# EAGLE schematic serv_open8_sotb (EAGLE 9.6.2)
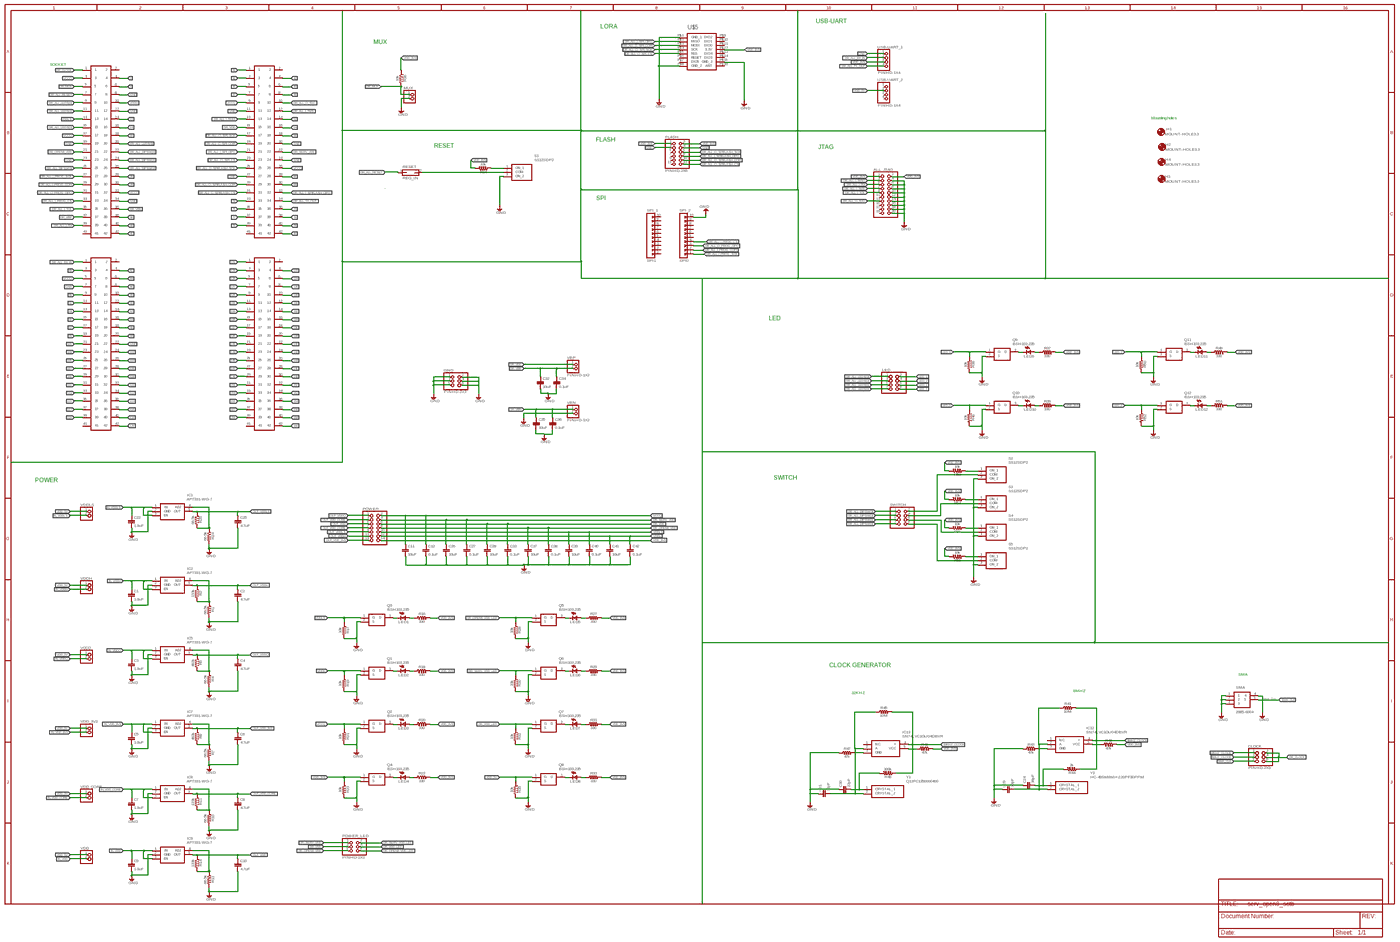
[diagram p0: schematic, sheet 1, overview]
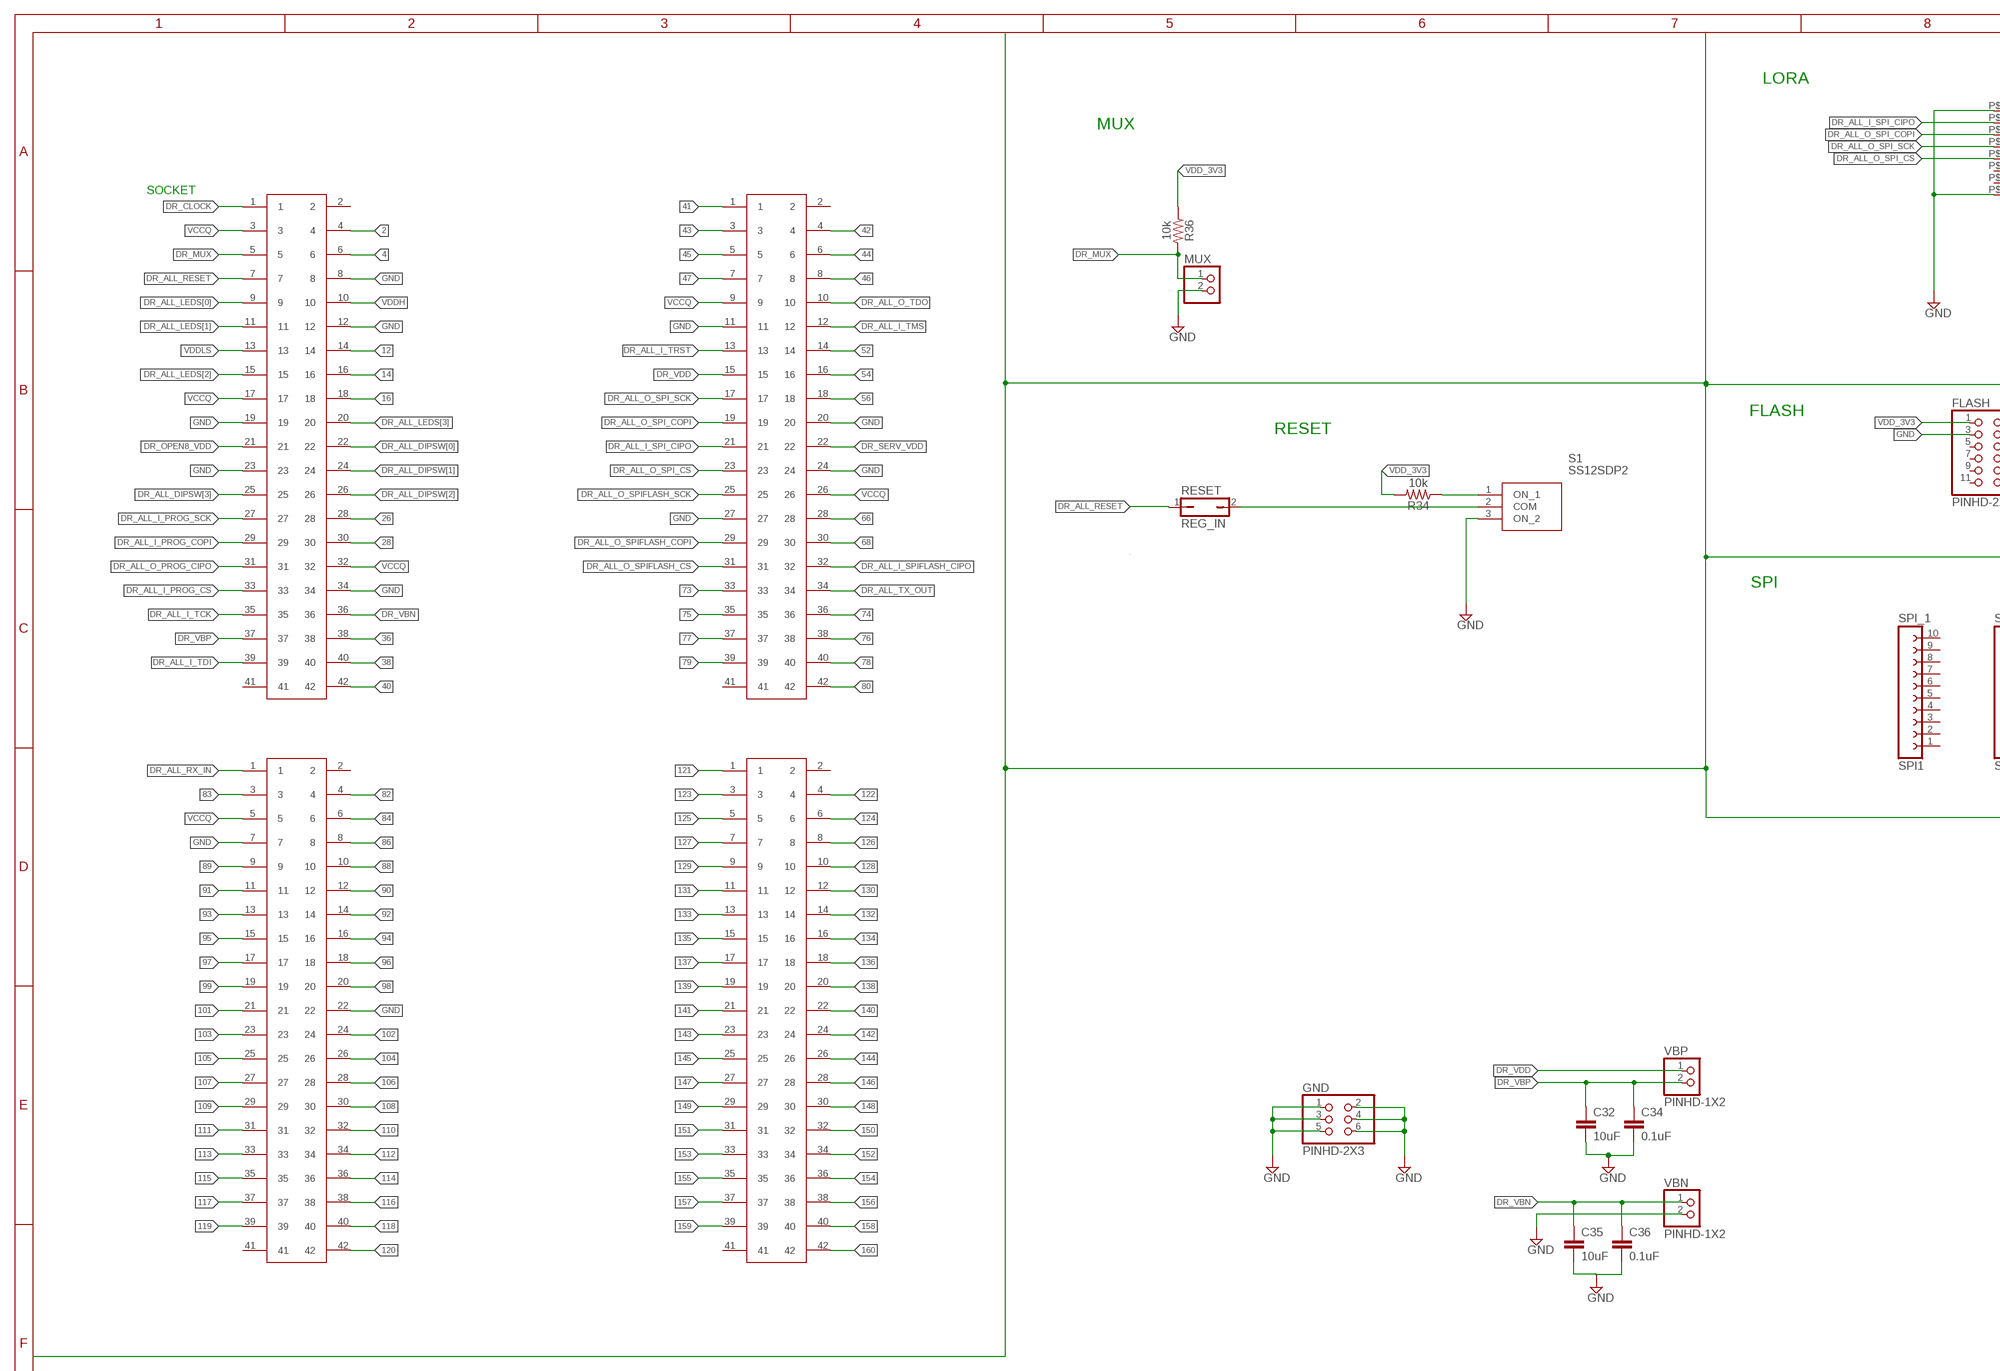
[diagram p1: schematic, sheet 1, part 1 of 4]
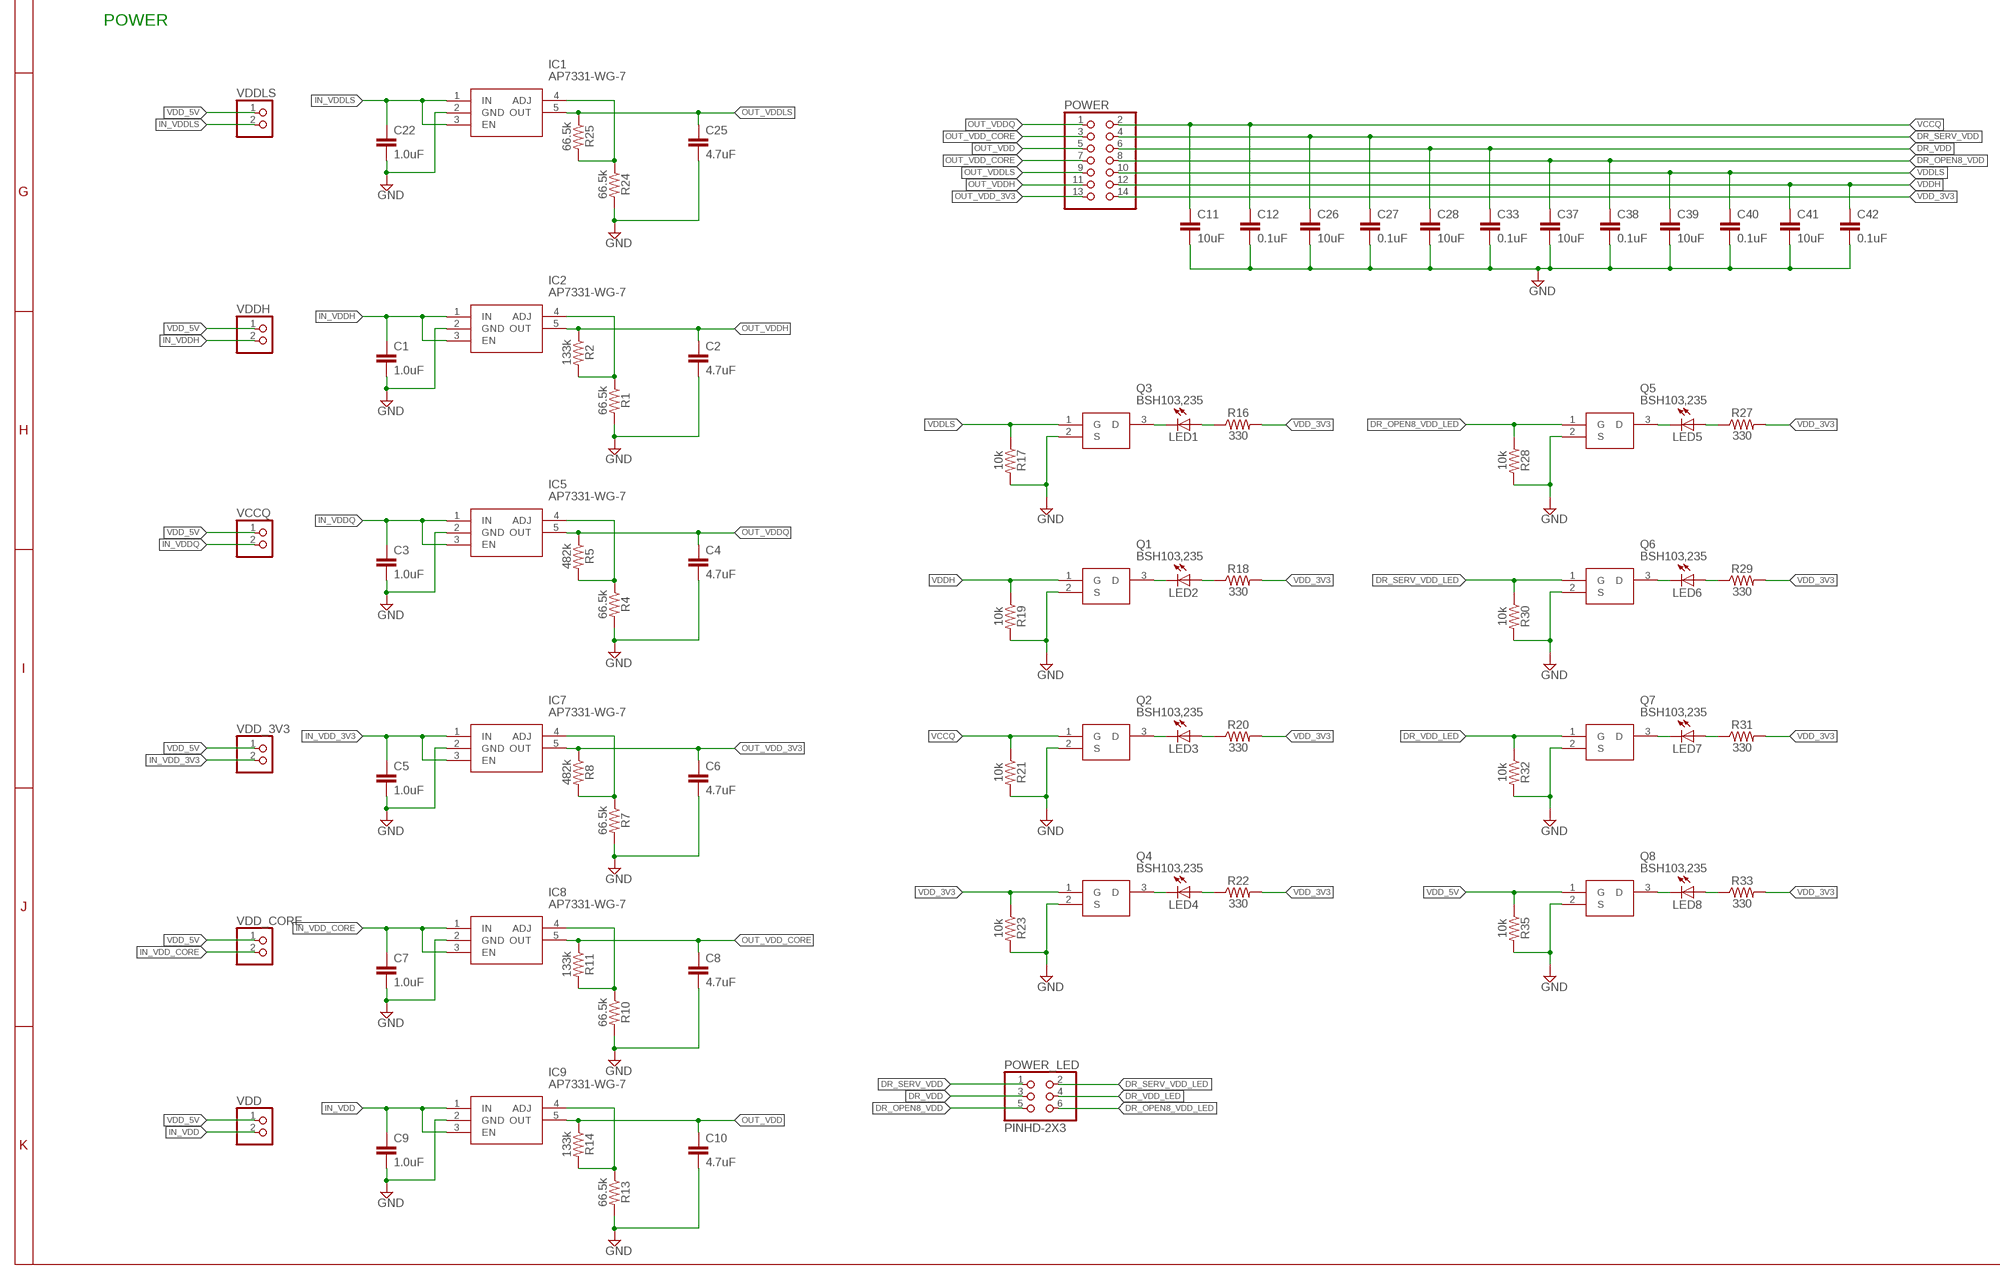
[diagram p2: schematic, sheet 1, part 2 of 4]
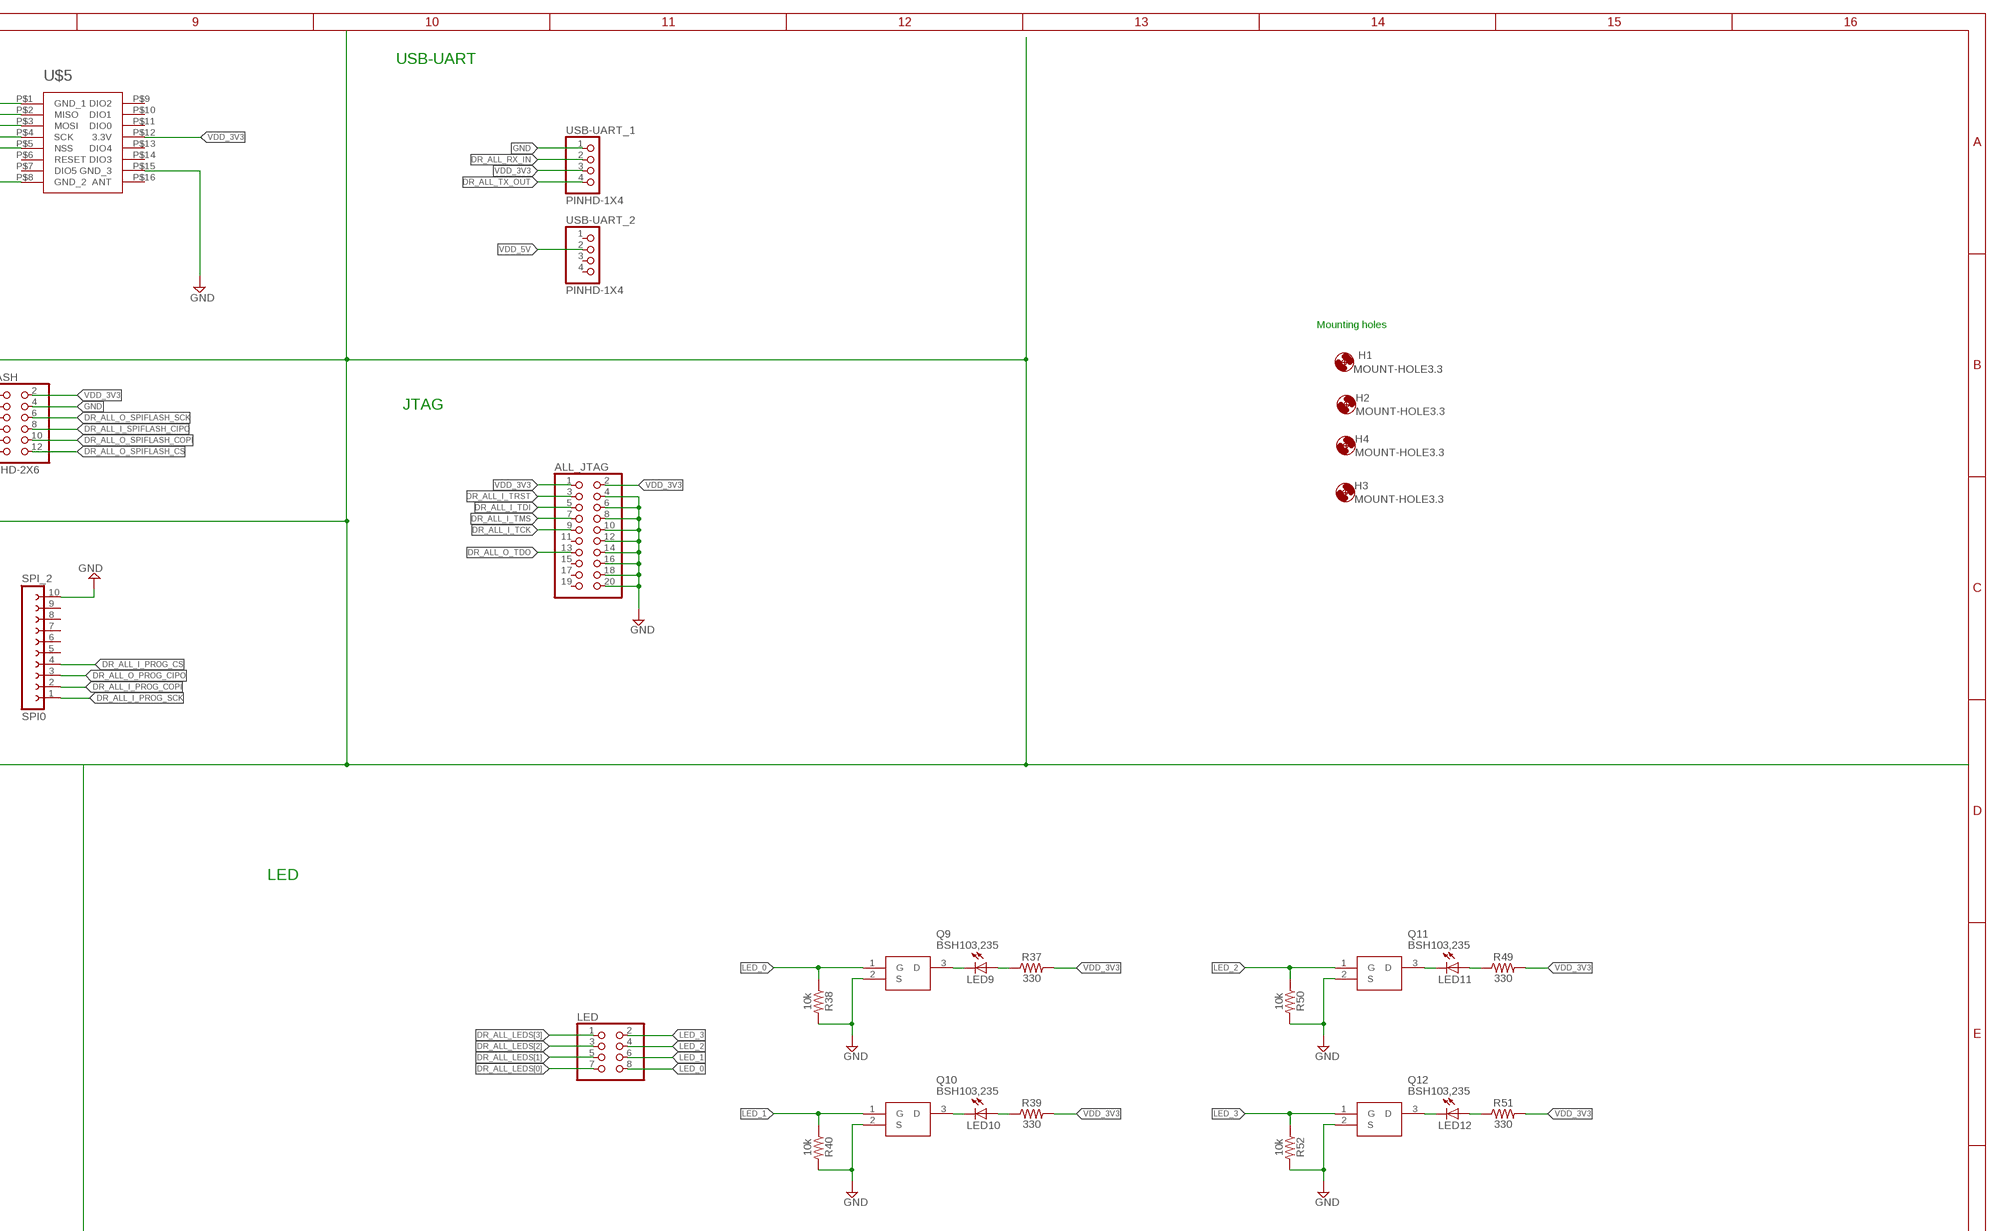
[diagram p3: schematic, sheet 1, part 3 of 4]
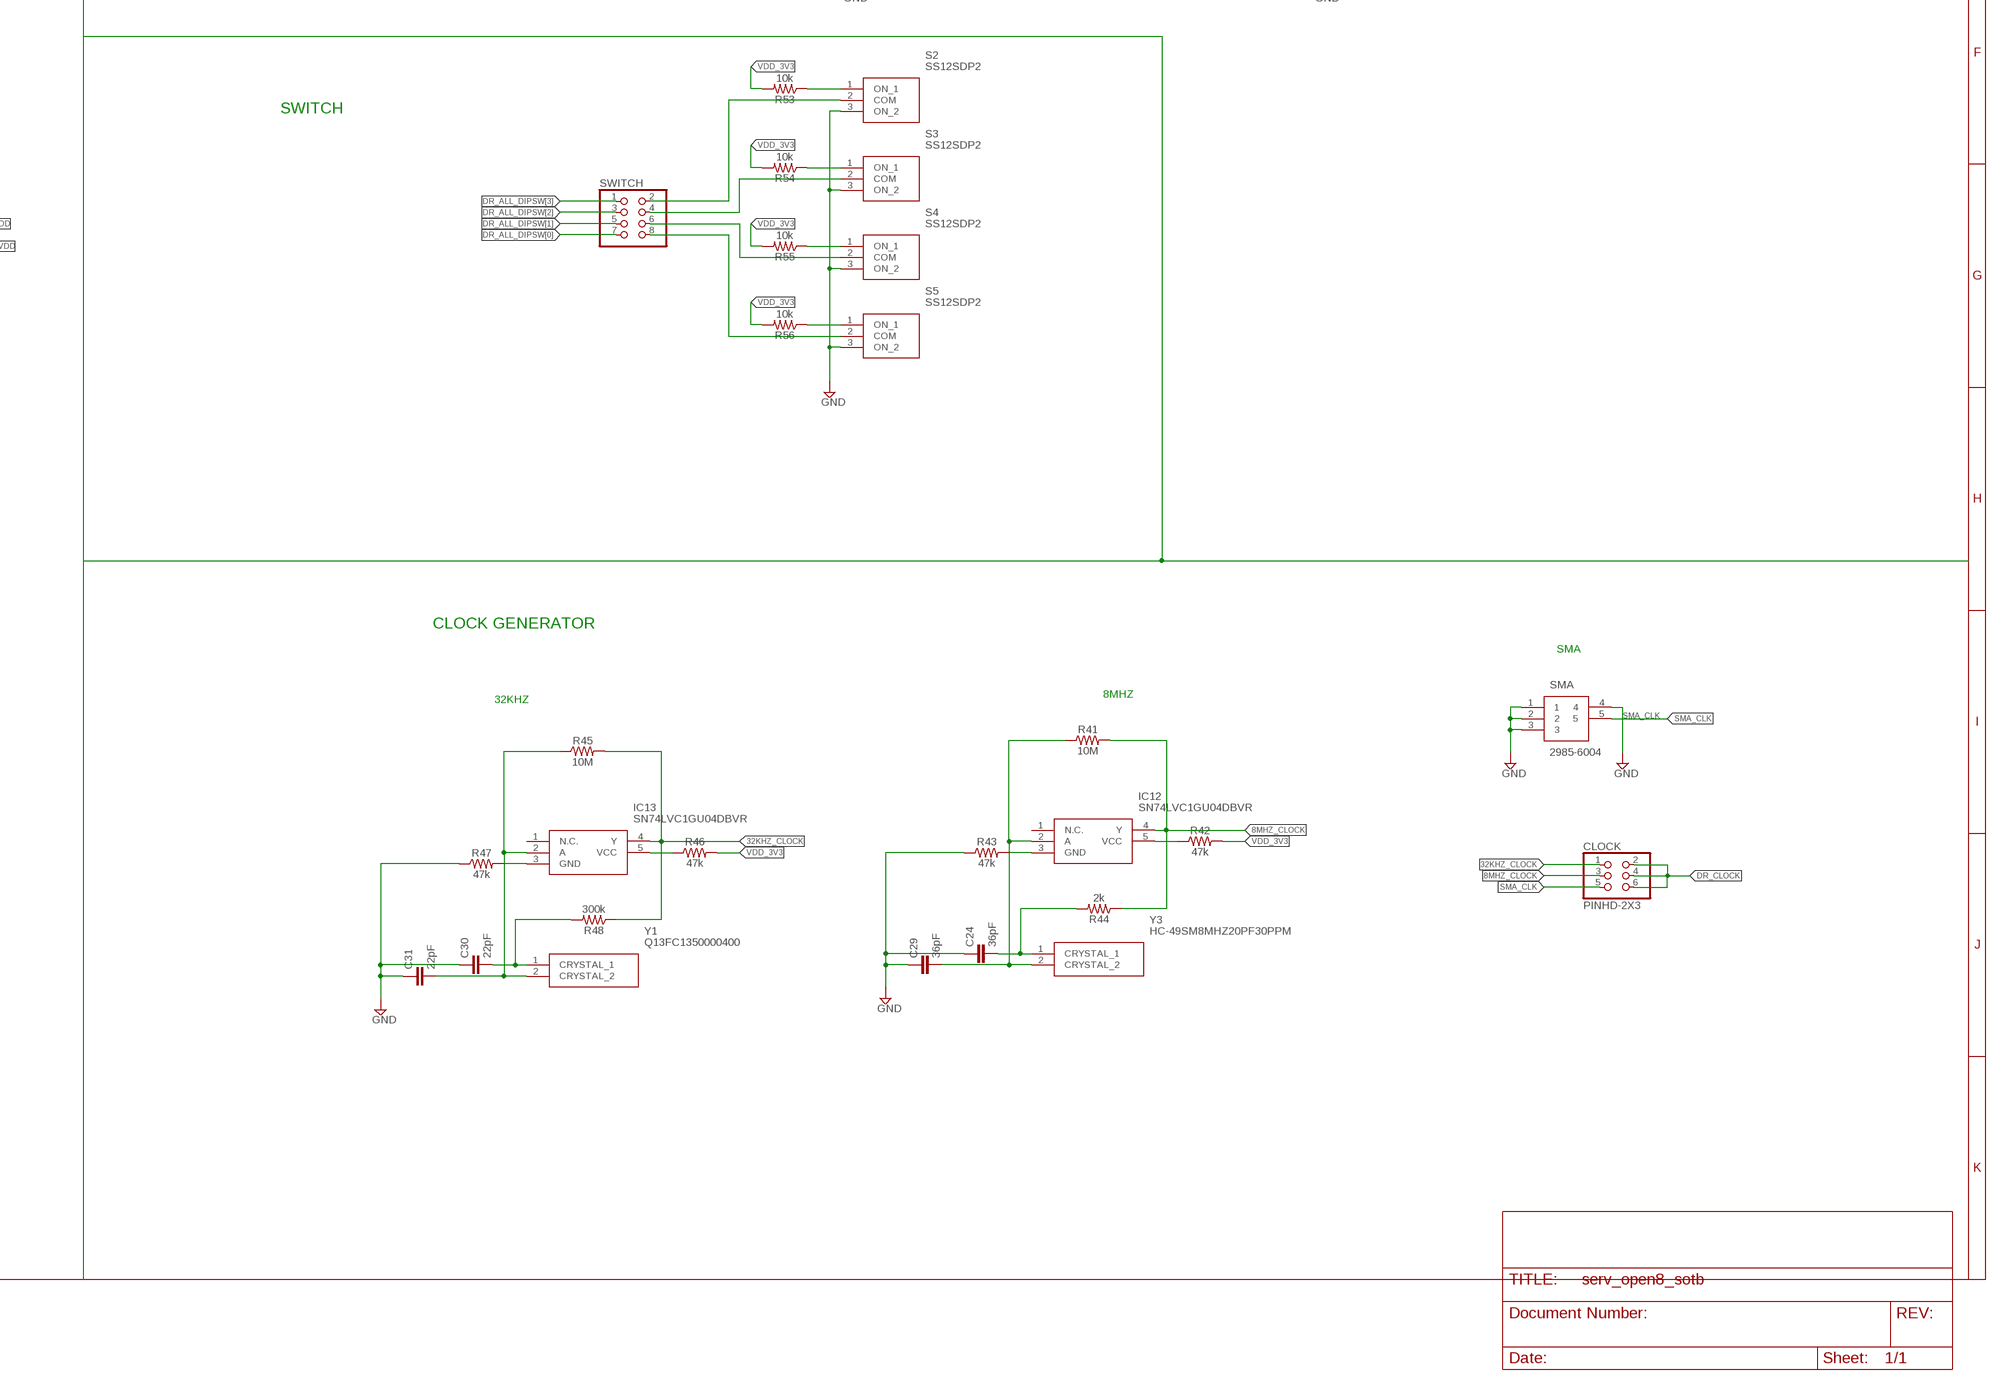
[diagram p4: schematic, sheet 1, part 4 of 4]

## Parts
ALL_JTAG  PINHD-2X10  [2X10]
C1  1.0uF  1.0UF-0805-25V-(+80/-20%)  [0805]
C2  4.7uF  1.0UF-0805-25V-(+80/-20%)  [0805]
C3  1.0uF  1.0UF-0805-25V-(+80/-20%)  [0805]
C4  4.7uF  1.0UF-0805-25V-(+80/-20%)  [0805]
C5  1.0uF  1.0UF-0805-25V-(+80/-20%)  [0805]
C6  4.7uF  1.0UF-0805-25V-(+80/-20%)  [0805]
C7  1.0uF  1.0UF-0805-25V-(+80/-20%)  [0805]
C8  4.7uF  1.0UF-0805-25V-(+80/-20%)  [0805]
C9  1.0uF  1.0UF-0805-25V-(+80/-20%)  [0805]
C10  4.7uF  1.0UF-0805-25V-(+80/-20%)  [0805]
C11  10uF  1.0UF-0805-25V-(+80/-20%)  [0805]
C12  0.1uF  1.0UF-0805-25V-(+80/-20%)  [0805]
C22  1.0uF  1.0UF-0805-25V-(+80/-20%)  [0805]
C24  36pF  1.0UF-0805-25V-(+80/-20%)  [0805]
C25  4.7uF  1.0UF-0805-25V-(+80/-20%)  [0805]
C26  10uF  1.0UF-0805-25V-(+80/-20%)  [0805]
C27  0.1uF  1.0UF-0805-25V-(+80/-20%)  [0805]
C28  10uF  1.0UF-0805-25V-(+80/-20%)  [0805]
C29  36pF  1.0UF-0805-25V-(+80/-20%)  [0805]
C30  22pF  1.0UF-0805-25V-(+80/-20%)  [0805]
C31  22pF  1.0UF-0805-25V-(+80/-20%)  [0805]
C32  10uF  1.0UF-0805-25V-(+80/-20%)  [0805]
C33  0.1uF  1.0UF-0805-25V-(+80/-20%)  [0805]
C34  0.1uF  1.0UF-0805-25V-(+80/-20%)  [0805]
C35  10uF  1.0UF-0805-25V-(+80/-20%)  [0805]
C36  0.1uF  1.0UF-0805-25V-(+80/-20%)  [0805]
C37  10uF  1.0UF-0805-25V-(+80/-20%)  [0805]
C38  0.1uF  1.0UF-0805-25V-(+80/-20%)  [0805]
C39  10uF  1.0UF-0805-25V-(+80/-20%)  [0805]
C40  0.1uF  1.0UF-0805-25V-(+80/-20%)  [0805]
C41  10uF  1.0UF-0805-25V-(+80/-20%)  [0805]
C42  0.1uF  1.0UF-0805-25V-(+80/-20%)  [0805]
CLOCK  PINHD-2X3  [2X03]
FLASH  PINHD-2X6  [2X06]
GND  PINHD-2X3  [2X03]
H1  MOUNT-HOLE3.3  [3,3]
H2  MOUNT-HOLE3.3  [3,3]
H3  MOUNT-HOLE3.3  [3,3]
H4  MOUNT-HOLE3.3  [3,3]
IC1  AP7331-WG-7  [SOT95P285X145-5N]
IC2  AP7331-WG-7  [SOT95P285X145-5N]
IC5  AP7331-WG-7  [SOT95P285X145-5N]
IC7  AP7331-WG-7  [SOT95P285X145-5N]
IC8  AP7331-WG-7  [SOT95P285X145-5N]
IC9  AP7331-WG-7  [SOT95P285X145-5N]
IC12  SN74LVC1GU04DBVR  [SOT95P280X145-5N]
IC13  SN74LVC1GU04DBVR  [SOT95P280X145-5N]
LED  PINHD-2X4  [2X04]
LED1  LEDCHIP-LED0805  [CHIP-LED0805]
LED2  LEDCHIP-LED0805  [CHIP-LED0805]
LED3  LEDCHIP-LED0805  [CHIP-LED0805]
LED4  LEDCHIP-LED0805  [CHIP-LED0805]
LED5  LEDCHIP-LED0805  [CHIP-LED0805]
LED6  LEDCHIP-LED0805  [CHIP-LED0805]
LED7  LEDCHIP-LED0805  [CHIP-LED0805]
LED8  LEDCHIP-LED0805  [CHIP-LED0805]
LED9  LEDCHIP-LED0805  [CHIP-LED0805]
LED10  LEDCHIP-LED0805  [CHIP-LED0805]
LED11  LEDCHIP-LED0805  [CHIP-LED0805]
LED12  LEDCHIP-LED0805  [CHIP-LED0805]
MUX  PINHD-1X2  [1X02]
POWER  PINHD-2X7  [2X07]
POWER_LED  PINHD-2X3  [2X03]
Q1  BSH103,235  [SOT95P230X110-3N]
Q2  BSH103,235  [SOT95P230X110-3N]
Q3  BSH103,235  [SOT95P230X110-3N]
Q4  BSH103,235  [SOT95P230X110-3N]
Q5  BSH103,235  [SOT95P230X110-3N]
Q6  BSH103,235  [SOT95P230X110-3N]
Q7  BSH103,235  [SOT95P230X110-3N]
Q8  BSH103,235  [SOT95P230X110-3N]
Q9  BSH103,235  [SOT95P230X110-3N]
Q10  BSH103,235  [SOT95P230X110-3N]
Q11  BSH103,235  [SOT95P230X110-3N]
Q12  BSH103,235  [SOT95P230X110-3N]
R1  66.5k  0.3OHM-0805-1/8W-1%  [0805]
R2  133k  0.3OHM-0805-1/8W-1%  [0805]
R4  66.5k  0.3OHM-0805-1/8W-1%  [0805]
R5  482k  0.3OHM-0805-1/8W-1%  [0805]
R7  66.5k  0.3OHM-0805-1/8W-1%  [0805]
R8  482k  0.3OHM-0805-1/8W-1%  [0805]
R10  66.5k  0.3OHM-0805-1/8W-1%  [0805]
R11  133k  0.3OHM-0805-1/8W-1%  [0805]
R13  66.5k  0.3OHM-0805-1/8W-1%  [0805]
R14  133k  0.3OHM-0805-1/8W-1%  [0805]
R16  330  0.3OHM-0805-1/8W-1%  [0805]
R17  10k  0.3OHM-0805-1/8W-1%  [0805]
R18  330  0.3OHM-0805-1/8W-1%  [0805]
R19  10k  0.3OHM-0805-1/8W-1%  [0805]
R20  330  0.3OHM-0805-1/8W-1%  [0805]
R21  10k  0.3OHM-0805-1/8W-1%  [0805]
R22  330  0.3OHM-0805-1/8W-1%  [0805]
R23  10k  0.3OHM-0805-1/8W-1%  [0805]
R24  66.5k  0.3OHM-0805-1/8W-1%  [0805]
R25  66.5k  0.3OHM-0805-1/8W-1%  [0805]
R27  330  0.3OHM-0805-1/8W-1%  [0805]
R28  10k  0.3OHM-0805-1/8W-1%  [0805]
R29  330  0.3OHM-0805-1/8W-1%  [0805]
R30  10k  0.3OHM-0805-1/8W-1%  [0805]
R31  330  0.3OHM-0805-1/8W-1%  [0805]
R32  10k  0.3OHM-0805-1/8W-1%  [0805]
R33  330  0.3OHM-0805-1/8W-1%  [0805]
R34  10k  0.3OHM-0805-1/8W-1%  [0805]
R35  10k  0.3OHM-0805-1/8W-1%  [0805]
R36  10k  0.3OHM-0805-1/8W-1%  [0805]
R37  330  0.3OHM-0805-1/8W-1%  [0805]
R38  10k  0.3OHM-0805-1/8W-1%  [0805]
R39  330  0.3OHM-0805-1/8W-1%  [0805]
R40  10k  0.3OHM-0805-1/8W-1%  [0805]
R41  10M  0.3OHM-0805-1/8W-1%  [0805]
R42  47k  0.3OHM-0805-1/8W-1%  [0805]
R43  47k  0.3OHM-0805-1/8W-1%  [0805]
R44  2k  0.3OHM-0805-1/8W-1%  [0805]
R45  10M  0.3OHM-0805-1/8W-1%  [0805]
R46  47k  0.3OHM-0805-1/8W-1%  [0805]
R47  47k  0.3OHM-0805-1/8W-1%  [0805]
R48  300k  0.3OHM-0805-1/8W-1%  [0805]
R49  330  0.3OHM-0805-1/8W-1%  [0805]
R50  10k  0.3OHM-0805-1/8W-1%  [0805]
R51  330  0.3OHM-0805-1/8W-1%  [0805]
R52  10k  0.3OHM-0805-1/8W-1%  [0805]
R53  10k  0.3OHM-0805-1/8W-1%  [0805]
R54  10k  0.3OHM-0805-1/8W-1%  [0805]
R55  10k  0.3OHM-0805-1/8W-1%  [0805]
R56  10k  0.3OHM-0805-1/8W-1%  [0805]
RESET  REG_IN  JP1Q  [JP1]
S1  SS12SDP2  [SS12SDP2]
S2  SS12SDP2  [SS12SDP2]
S3  SS12SDP2  [SS12SDP2]
S4  SS12SDP2  [SS12SDP2]
S5  SS12SDP2  [SS12SDP2]
SMA  2985-6004  [29856004]
SPI_1  SPI1  FE10-1  [FE10]
SPI_2  SPI0  FE10-1  [FE10]
SWITCH  PINHD-2X4  [2X04]
U$1  2X41_HEADER  [2X41_HEADER]
U$2  2X41_HEADER  [2X41_HEADER]
U$3  2X41_HEADER  [2X41_HEADER]
U$4  2X41_HEADER  [2X41_HEADER]
U$5  RFM95W-915S2  [RFM95W-915S2]
USB-UART_1  PINHD-1X4  [1X04]
USB-UART_2  PINHD-1X4  [1X04]
VBN  PINHD-1X2  [1X02]
VBP  PINHD-1X2  [1X02]
VCCQ  PINHD-1X2  [1X02]
VDD  PINHD-1X2  [1X02]
VDD_3V3  PINHD-1X2  [1X02]
VDD_CORE  PINHD-1X2  [1X02]
VDDH  PINHD-1X2  [1X02]
VDDLS  PINHD-1X2  [1X02]
Y1  Q13FC1350000400  [Q13FC1350000400]
Y3  HC-49SM8MHZ20PF30PPM  [HC49SM8MHZ20PF30PPM]

## Nets
2: U$1.4
4: U$1.6
8MHZ_CLOCK: CLOCK.3 IC12.4(Y) R41.2 R44.1
12: U$1.14
14: U$1.16
16: U$1.18
26: U$1.28
28: U$1.30
32KHZ_CLOCK: CLOCK.1 IC13.4(Y) R45.2 R48.1
36: U$1.38
38: U$1.40
40: U$1.42
41: U$2.1
42: U$2.4
43: U$2.3
44: U$2.6
45: U$2.5
46: U$2.8
47: U$2.7
52: U$2.14
54: U$2.16
56: U$2.18
66: U$2.28
68: U$2.30
73: U$2.33
74: U$2.36
75: U$2.35
76: U$2.38
77: U$2.37
78: U$2.40
79: U$2.39
80: U$2.42
82: U$3.4
83: U$3.3
84: U$3.6
86: U$3.8
88: U$3.10
89: U$3.9
90: U$3.12
91: U$3.11
92: U$3.14
93: U$3.13
94: U$3.16
95: U$3.15
96: U$3.18
97: U$3.17
98: U$3.20
99: U$3.19
101: U$3.21
102: U$3.24
103: U$3.23
104: U$3.26
105: U$3.25
106: U$3.28
107: U$3.27
108: U$3.30
109: U$3.29
110: U$3.32
111: U$3.31
112: U$3.34
113: U$3.33
114: U$3.36
115: U$3.35
116: U$3.38
117: U$3.37
118: U$3.40
119: U$3.39
120: U$3.42
121: U$4.1
122: U$4.4
123: U$4.3
124: U$4.6
125: U$4.5
126: U$4.8
127: U$4.7
128: U$4.10
129: U$4.9
130: U$4.12
131: U$4.11
132: U$4.14
133: U$4.13
134: U$4.16
135: U$4.15
136: U$4.18
137: U$4.17
138: U$4.20
139: U$4.19
140: U$4.22
141: U$4.21
142: U$4.24
143: U$4.23
144: U$4.26
145: U$4.25
146: U$4.28
147: U$4.27
148: U$4.30
149: U$4.29
150: U$4.32
151: U$4.31
152: U$4.34
153: U$4.33
154: U$4.36
155: U$4.35
156: U$4.38
157: U$4.37
158: U$4.40
159: U$4.39
160: U$4.42
DR_ALL_DIPSW[0]: SWITCH.7 U$1.22
DR_ALL_DIPSW[1]: SWITCH.5 U$1.24
DR_ALL_DIPSW[2]: SWITCH.3 U$1.26
DR_ALL_DIPSW[3]: SWITCH.1 U$1.25
DR_ALL_I_PROG_COPI: SPI_2.2 U$1.29
DR_ALL_I_PROG_CS: SPI_2.4 U$1.33
DR_ALL_I_PROG_SCK: SPI_2.1 U$1.27
DR_ALL_I_SPI_CIPO: U$2.21 U$5.P$2(MISO)
DR_ALL_I_SPIFLASH_CIPO: FLASH.8 U$2.32
DR_ALL_I_TCK: ALL_JTAG.9 U$1.35
DR_ALL_I_TDI: ALL_JTAG.5 U$1.39
DR_ALL_I_TMS: ALL_JTAG.7 U$2.12
DR_ALL_I_TRST: ALL_JTAG.3 U$2.13
DR_ALL_LEDS[0]: LED.7 U$1.9
DR_ALL_LEDS[1]: LED.5 U$1.11
DR_ALL_LEDS[2]: LED.3 U$1.15
DR_ALL_LEDS[3]: LED.1 U$1.20
DR_ALL_O_PROG_CIPO: SPI_2.3 U$1.31
DR_ALL_O_SPI_COPI: U$2.19 U$5.P$3(MOSI)
DR_ALL_O_SPI_CS: U$2.23 U$5.P$5(NSS)
DR_ALL_O_SPI_SCK: U$2.17 U$5.P$4(SCK)
DR_ALL_O_SPIFLASH_COPI: FLASH.10 U$2.29
DR_ALL_O_SPIFLASH_CS: FLASH.12 U$2.31
DR_ALL_O_SPIFLASH_SCK: FLASH.6 U$2.25
DR_ALL_O_TDO: ALL_JTAG.13 U$2.10
DR_ALL_RESET: RESET.1 U$1.7
DR_ALL_RX_IN: U$3.1 USB-UART_1.2
DR_ALL_TX_OUT: U$2.34 USB-UART_1.4
DR_CLOCK: CLOCK.2 CLOCK.4 CLOCK.6 U$1.1
DR_MUX: MUX.1 R36.2 U$1.5
DR_OPEN8_VDD: C37.1 C38.1 POWER.8 POWER_LED.5 U$1.21
DR_OPEN8_VDD_LED: POWER_LED.6 Q5.1(G) R28.1
DR_SERV_VDD: C26.1 C27.1 POWER.4 POWER_LED.1 U$2.22
DR_SERV_VDD_LED: POWER_LED.2 Q6.1(G) R30.1
DR_VBN: C35.1 C36.1 U$1.36 VBN.1
DR_VBP: C32.1 C34.1 U$1.37 VBP.2
DR_VDD: C28.1 C33.1 POWER.6 POWER_LED.3 U$2.15 VBP.1
DR_VDD_LED: POWER_LED.4 Q7.1(G) R32.1
GND: ALL_JTAG.4 ALL_JTAG.6 ALL_JTAG.8 ALL_JTAG.10 ALL_JTAG.12 ALL_JTAG.14 ALL_JTAG.16 ALL_JTAG.18 ALL_JTAG.20 C1.2 C2.2 C3.2 C4.2 C5.2 C6.2 C7.2 C8.2 C9.2 C10.2 C11.2 C12.2 C22.2 C24.1 C25.2 C26.2 C27.2 C28.2 C29.1 C30.1 C31.1 C32.2 C33.2 C34.2 C35.2 C36.2 C37.2 C38.2 C39.2 C40.2 C41.2 C42.2 FLASH.3 FLASH.4 GND.1 GND.2 GND.3 GND.4 GND.5 GND.6 IC1.2(GND) IC2.2(GND) IC5.2(GND) IC7.2(GND) IC8.2(GND) IC9.2(GND) MUX.2 Q1.2(S) Q2.2(S) Q3.2(S) Q4.2(S) Q5.2(S) Q6.2(S) Q7.2(S) Q8.2(S) Q9.2(S) Q10.2(S) Q11.2(S) Q12.2(S) R1.2 R4.2 R7.2 R10.2 R13.2 R17.2 R19.2 R21.2 R23.2 R24.2 R28.2 R30.2 R32.2 R35.2 R38.2 R40.2 R43.1 R47.1 R50.2 R52.2 S1.3(ON_2) S2.3(ON_2) S3.3(ON_2) S4.3(ON_2) S5.3(ON_2) SMA.1 SMA.2 SMA.3 SMA.4 SPI_2.10 U$1.8 U$1.12 U$1.19 U$1.23 U$1.34 U$2.11 U$2.20 U$2.24 U$2.27 U$3.7 U$3.22 U$5.P$1(GND_1) U$5.P$8(GND_2) U$5.P$15(GND_3) USB-UART_1.1 VBN.2
IN_VDD: C9.1 IC9.1(IN) IC9.3(EN) VDD.2
IN_VDD_3V3: C5.1 IC7.1(IN) IC7.3(EN) VDD_3V3.2
IN_VDD_CORE: C7.1 IC8.1(IN) IC8.3(EN) VDD_CORE.2
IN_VDDH: C1.1 IC2.1(IN) IC2.3(EN) VDDH.2
IN_VDDLS: C22.1 IC1.1(IN) IC1.3(EN) VDDLS.2
IN_VDDQ: C3.1 IC5.1(IN) IC5.3(EN) VCCQ.2
LED_0: LED.8 Q9.1(G) R38.1
LED_1: LED.6 Q10.1(G) R40.1
LED_2: LED.4 Q11.1(G) R50.1
LED_3: LED.2 Q12.1(G) R52.1
N$1: IC2.4(ADJ) R1.1 R2.2
N$3: IC5.4(ADJ) R4.1 R5.2
N$5: IC7.4(ADJ) R7.1 R8.2
N$7: IC8.4(ADJ) R10.1 R11.2
N$9: IC9.4(ADJ) R13.1 R14.2
N$10: R34.1 S1.1(ON_1)
N$11: LED2.C Q1.3(D)
N$13: LED1.C Q3.3(D)
N$14: LED2.A R18.1
N$15: LED9.C Q9.3(D)
N$16: LED9.A R37.1
N$17: LED1.A R16.1
N$18: IC1.4(ADJ) R24.1 R25.2
N$21: LED3.C Q2.3(D)
N$22: LED3.A R20.1
N$23: RESET.2 S1.2(COM)
N$24: LED4.C Q4.3(D)
N$28: LED4.A R22.1
N$30: LED10.C Q10.3(D)
N$31: LED5.C Q5.3(D)
N$32: LED5.A R27.1
N$33: LED10.A R39.1
N$34: LED6.C Q6.3(D)
N$36: LED6.A R29.1
N$39: C29.2 IC12.2(A) R41.1 Y3.2(CRYSTAL_2)
N$44: LED7.C Q7.3(D)
N$45: LED7.A R31.1
N$46: C24.2 R44.2 Y3.1(CRYSTAL_1)
N$47: LED8.C Q8.3(D)
N$48: LED8.A R33.1
N$49: IC12.3(GND) R43.2
N$50: IC12.5(VCC) R42.1
N$51: C31.2 IC13.2(A) R45.1 Y1.2(CRYSTAL_2)
N$59: LED11.C Q11.3(D)
N$60: C30.2 R48.2 Y1.1(CRYSTAL_1)
N$61: LED11.A R49.1
N$62: IC13.3(GND) R47.2
N$63: LED12.C Q12.3(D)
N$64: LED12.A R51.1
N$65: IC13.5(VCC) R46.1
N$66: R53.1 S2.1(ON_1)
N$67: R54.1 S3.1(ON_1)
N$68: R55.1 S4.1(ON_1)
N$69: R56.1 S5.1(ON_1)
N$70: S2.2(COM) SWITCH.2
N$71: S3.2(COM) SWITCH.4
N$72: S4.2(COM) SWITCH.6
N$73: S5.2(COM) SWITCH.8
OUT_VDD: C10.1 IC9.5(OUT) POWER.5 R14.1
OUT_VDD_3V3: C6.1 IC7.5(OUT) POWER.13 R8.1
OUT_VDD_CORE: C8.1 IC8.5(OUT) POWER.3 POWER.7 R11.1
OUT_VDDH: C2.1 IC2.5(OUT) POWER.11 R2.1
OUT_VDDLS: C25.1 IC1.5(OUT) POWER.9 R25.1
OUT_VDDQ: C4.1 IC5.5(OUT) POWER.1 R5.1
SMA_CLK: CLOCK.5 SMA.5
VCCQ: C11.1 C12.1 POWER.2 Q2.1(G) R21.1 U$1.3 U$1.17 U$1.32 U$2.9 U$2.26 U$3.5
VDD_3V3: ALL_JTAG.1 ALL_JTAG.2 FLASH.1 FLASH.2 POWER.14 Q4.1(G) R16.2 R18.2 R20.2 R22.2 R23.1 R27.2 R29.2 R31.2 R33.2 R34.2 R36.1 R37.2 R39.2 R42.2 R46.2 R49.2 R51.2 R53.2 R54.2 R55.2 R56.2 U$5.P$12(3.3V) USB-UART_1.3
VDD_5V: Q8.1(G) R35.1 USB-UART_2.2 VCCQ.1 VDD.1 VDD_3V3.1 VDD_CORE.1 VDDH.1 VDDLS.1
VDDH: C41.1 C42.1 POWER.12 Q1.1(G) R19.1 U$1.10
VDDLS: C39.1 C40.1 POWER.10 Q3.1(G) R17.1 U$1.13
Unconnected: ALL_JTAG.11 ALL_JTAG.15 ALL_JTAG.17 ALL_JTAG.19 FLASH.5 FLASH.7 FLASH.9 FLASH.11 IC12.1(N.C.) IC13.1(N.C.) SPI_1.1 SPI_1.2 SPI_1.3 SPI_1.4 SPI_1.5 SPI_1.6 SPI_1.7 SPI_1.8 SPI_1.9 SPI_1.10 SPI_2.5 SPI_2.6 SPI_2.7 SPI_2.8 SPI_2.9 U$1.2 U$1.41 U$2.2 U$2.41 U$3.2 U$3.41 U$4.2 U$4.41 U$5.P$6(RESET) U$5.P$7(DIO5) U$5.P$9(DIO2) U$5.P$10(DIO1) U$5.P$11(DIO0) U$5.P$13(DIO4) U$5.P$14(DIO3) U$5.P$16(ANT) USB-UART_2.1 USB-UART_2.3 USB-UART_2.4

## Notes on the sheet
- USB-UART
- LORA
- MUX
- SOCKET
- Mounting holes
- FLASH
- RESET | JTAG
- SPI
- LED
- SWITCH
- POWER
- CLOCK GENERATOR
- SMA
- 8MHZ
- 32KHZ

## Library data of the parts
ALL_JTAG = pinhead:PINHD-2X10: PIN HEADER
C1 C3 C5 C7 C9 C22 = SparkFun-Capacitors:1.0UF: 1µF ceramic capacitors A capacitor is a passive two-terminal electrical component used to store electrical energy temporarily in an electric field.; PROD_ID: CAP-11625
C2 C4 C6 C8 C10-C12 C24-C42 = SparkFun-Capacitors:1.0UF: 1µF ceramic capacitors A capacitor is a passive two-terminal electrical component used to store electrical energy temporarily in an electric field.; PROD_ID: CAP-11625; VALUE: 1.0uF
CLOCK GND POWER_LED = Connector:PINHD-2X3: PIN HEADER; CATEGORY: CONNECTOR; SUB-CATEGORY: PIN-HEADER
FLASH = Connector:PINHD-2X6: PIN HEADER; CATEGORY: CONNECTOR; SUB-CATEGORY: PIN-HEADER
H1-H4 = holes:MOUNT-HOLE: MOUNTING HOLE with drill center marker
IC1 IC2 IC5 IC7-IC9 = SamacSys_Parts:AP7331-WG-7: LDO Voltage Regulators LDO SOT-25 ADJUSTABLE 300MA Source: Datasheet <http://uk.rs-online.com/web/p/products/7513083>; ARROW_PART_NUMBER: AP7331-WG-7; ARROW_PRICE-STOCK: https://www.arrow.com/en/products/ap7331-wg-7/diodes-incorporated?region=nac; DESCRIPTION: LDO Voltage Regulators LDO SOT-25 ADJUSTABLE 300MA; HEIGHT: 1.45mm; MANUFACTURER_NAME: Diodes Inc.; MANUFACTURER_PART_NUMBER: AP7331-WG-7; MOUSER_PART_NUMBER: 621-AP7331-WG-7; MOUSER_PRICE-STOCK: https://www.mouser.co.uk/ProductDetail/Diodes-Incorporated/AP7331-WG-7?qs=vIZ3oKQCLxr9PiNSCoXN%2FQ%3D%3D
IC12 IC13 = SamacSys_Parts:SN74LVC1GU04DBVR: Single Inverter Gate Source: Datasheet <http://www.ti.com/lit/ds/symlink/sn74lvc1gu04.pdf>; ARROW_PART_NUMBER: SN74LVC1GU04DBVR; ARROW_PRICE-STOCK: https://www.arrow.com/en/products/sn74lvc1gu04dbvr/texas-instruments?region=nac; DESCRIPTION: Single Inverter Gate; HEIGHT: 1.45mm; MANUFACTURER_NAME: Texas Instruments; MANUFACTURER_PART_NUMBER: SN74LVC1GU04DBVR; MOUSER_PART_NUMBER: 595-SN74LVC1GU04DBVR; MOUSER_PRICE-STOCK: https://www.mouser.co.uk/ProductDetail/Texas-Instruments/SN74LVC1GU04DBVR?qs=xJkDX%2FqrskOXGoPUy6IENA%3D%3D
LED SWITCH = adafruit:PINHD-2X4: PIN HEADER
LED1-LED12 = adafruit:LED: LED OSRAM: - CHIPLED LG R971, LG N971, LY N971, LG Q971, LY Q971, LO R971, LY R971 LH N974, LH R974 LS Q976, LO Q976, LY Q976 LO Q996 - Hyper CHIPLED LW Q18S LB Q993, LB Q99A, LB R99A - SideLED LS A670, LO A670, LY A670, LG A670, LP A670 LB A673, LV A673, LT A673, LW A673 LH A674 LY A675 LS A676, LA A676, LO A676, LY A676, LW A676 LS A679, LY A679, LG A679 - Hyper Micro SIDELED® LS Y876, LA Y876, LO Y876, LY Y876 LT Y87S - SmartLED LW L88C, LW L88S LB L89C, LB L89S, LG L890 LS L89K, LO L89K, LY L89K LS L896, LA L896, LO L896, LY L896 - TOPLED LS T670, LO T670, LY T670, LG T670, LP T670 LSG T670, LSP T670, LSY T670, LOP T670, LYG T670 LG T671, LOG T671, LSG T671 LB T673, LV T673, LT T673, LW T673 LH T674 LS T676, LA T676, LO T676, LY T676, LB T676, LH T676, LSB T676, LW T676 LB T67C, LV T67C, LT T67C, LS T67K, LO T67K, LY T67K, LW E67C LS E67B, LA E67B, LO E67B, LY E67B, LB E67C, LV E67C, LT E67C LW T67C LS T679, LY T679, LG T679 LS T770, LO T770, LY T770, LG T770, LP T770 LB T773, LV T773, LT T773, LW T773 LH T774 LS E675, LA E675, LY E675, LS T675 LS T776, LA T776, LO T776, LY T776, LB T776 LHGB T686 LT T68C, LB T68C - Hyper Mini TOPLED® LB M676 - Mini TOPLED Santana® LG M470 LS M47K, LO M47K, LY M47K Source: http://www.osram.convergy.de/
MUX VCCQ VDD VDD_3V3 VDD_CORE VDDH VDDLS = pinhead:PINHD-1X2: PIN HEADER
POWER = pinhead:PINHD-2X7: PIN HEADER
Q1-Q12 = SamacSys_Parts:BSH103,235: MOSFET TAPE13 MOSFET Source: Datasheet <http://www.nxp.com/documents/data_sheet/BSH103.pdf>; DESCRIPTION: MOSFET TAPE13 MOSFET; HEIGHT: 1.1mm; MANUFACTURER_NAME: Nexperia; MANUFACTURER_PART_NUMBER: BSH103,235; MOUSER_PART_NUMBER: 771-BSH103235; MOUSER_PRICE-STOCK: https://www.mouser.co.uk/ProductDetail/Nexperia/BSH103235?qs=me8TqzrmIYVhbJIwsR7ziw%3D%3D
R1 R2 R4 R5 R7 R8 R10 R11 R13 R14 R16-R25 R27-R56 = SparkFun-Resistors:0.3OHM: 0.3Ω resistor A resistor is a passive two-terminal electrical component that implements electrical resistance as a circuit element. Resistors act to reduce current flow, and, at the same time, act to lower voltage levels within circuits. - Wikipedia; PROD_ID: RES-11622; VALUE: 0.3
RESET = jumper:JP1Q: JUMPER
S1-S5 = SamacSys_Parts:SS12SDP2: Switch, Slide,Sub Miniature,Top Actuated,SPDT, On-none-On Source: Datasheet; DESCRIPTION: Switch, Slide,Sub Miniature,Top Actuated,SPDT, On-none-On; HEIGHT: 4mm; MANUFACTURER_NAME: NKK Switches; MANUFACTURER_PART_NUMBER: SS12SDP2; MOUSER_PART_NUMBER: 633-SS12SDP2; MOUSER_PRICE-STOCK: https://www.mouser.co.uk/ProductDetail/NKK-Switches/SS12SDP2?qs=Av7JdS0MGqKsG%252BWOKKtU2w%3D%3D
SMA = SamacSys_Parts:2985-6004: RF Connectors / Coaxial Connectors SMA F PCB Thru-Hole Conn, 50-OHMS 1000 Source: Datasheet <https://componentsearchengine.com//2985-6004.pdf>; DESCRIPTION: RF Connectors / Coaxial Connectors SMA F PCB Thru-Hole Conn, 50-OHMS 1000; HEIGHT: 9.54mm; MANUFACTURER_NAME: Amphenol; MANUFACTURER_PART_NUMBER: 2985-6004; MOUSER_PART_NUMBER: 523-2985-6004; MOUSER_PRICE-STOCK: https://www.mouser.co.uk/ProductDetail/Amphenol-SV-Microwave/2985-6004?qs=jyo2EwfRkUNkt8LGijRXFQ%3D%3D
SPI_1 SPI_2 = con-lsta:FE10-1: FEMALE HEADER; OC_FARNELL: unknown; OC_NEWARK: unknown
U$1-U$4 = Duy:2X41_HEADER
U$5 = Duy:RFM95W-915S2
USB-UART_1 USB-UART_2 = Connector:PINHD-1X4: PIN HEADER; CATEGORY: CONNECTOR; SUB-CATEGORY: PIN-HEADER
VBN VBP = Connector:PINHD-1X2: PIN HEADER; CATEGORY: CONNECTOR; SUB-CATEGORY: PIN-HEADER
Y1 = SamacSys_Parts:Q13FC1350000400: SMD Crystal Resonators 32.768KHz +/-20ppm SMD-3215_2P RoHS Source: Datasheet <https://datasheet.lcsc.com/szlcsc/1901081604_Seiko-Epson-Q13FC1350000400_C32346.pdf>; DESCRIPTION: SMD Crystal Resonators 32.768KHz +/-20ppm SMD-3215_2P RoHS; HEIGHT: 0.9mm; MANUFACTURER_NAME: SEIKO EPSON; MANUFACTURER_PART_NUMBER: Q13FC1350000400
Y3 = SamacSys_Parts:HC-49SM8MHZ20PF30PPM: Crystal Source: Datasheet <https://datasheet.lcsc.com/szlcsc/Zhejiang-Abel-Elec-HC-49SM8MHz20pF30ppm_C107426.pdf>; DESCRIPTION: Crystal; HEIGHT: 4mm; MANUFACTURER_NAME: TAE(Zhejiang Abel Elec); MANUFACTURER_PART_NUMBER: HC-49SM8MHz20pF30ppm